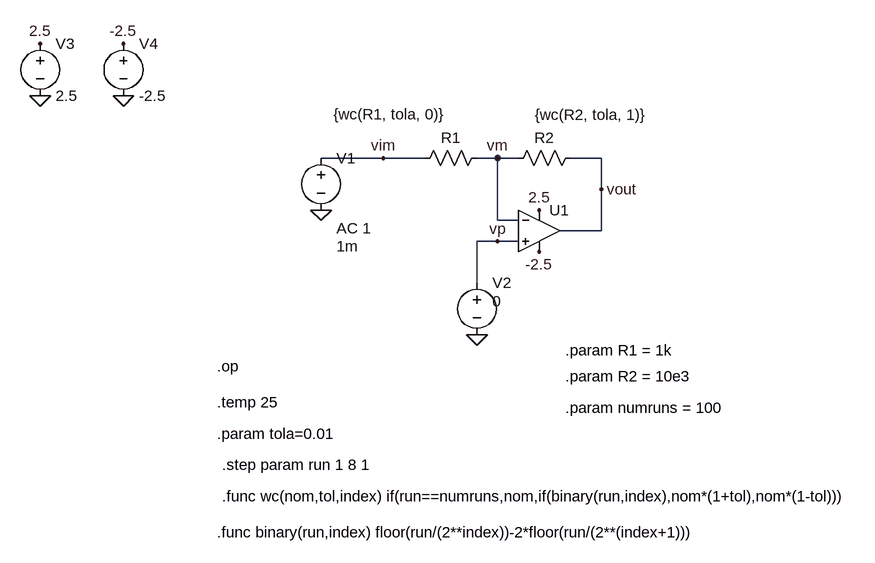
[diagram p0: schematic amplifier_wc.asc]
amplifier_wc.asc, the LTspice schematic file:
Version 4
SHEET 1 880 736
WIRE 16 48 -80 48
WIRE 80 48 16 48
WIRE 192 48 160 48
WIRE 224 48 192 48
WIRE 352 48 304 48
WIRE 352 96 352 48
WIRE 192 144 192 48
WIRE 224 144 192 144
WIRE 352 160 352 96
WIRE 352 160 288 160
WIRE 192 176 160 176
WIRE 224 176 192 176
WIRE 160 240 160 176
FLAG -80 128 0
FLAG -384 -48 0
FLAG -512 -48 0
FLAG -512 -128 2.5
FLAG -384 -128 -2.5
FLAG 256 128 2.5
FLAG 256 192 -2.5
FLAG 16 48 vim
FLAG 352 96 vout
FLAG 192 48 vm
FLAG 192 176 vp
FLAG 160 320 0
SYMBOL Opamps\\UniversalOpamp2 256 160 R0
SYMATTR InstName U1
SYMATTR SpiceModel level.1
SYMATTR Value2 Avol=10Meg GBW=1Meg Slew=10Meg
SYMBOL res 176 32 R90
WINDOW 0 0 56 VBottom 2
WINDOW 3 -67 150 VTop 2
SYMATTR InstName R1
SYMATTR Value {wc(R1, tola, 0)}
SYMBOL res 320 32 R90
WINDOW 0 0 56 VBottom 2
WINDOW 3 -66 -16 VTop 2
SYMATTR InstName R2
SYMATTR Value {wc(R2, tola, 1)}
SYMBOL voltage -80 32 R0
WINDOW 123 24 124 Left 2
WINDOW 39 0 0 Left 0
WINDOW 3 24 152 Left 2
SYMATTR Value2 AC 1
SYMATTR Value 1m
SYMATTR InstName V1
SYMBOL voltage -512 -144 R0
WINDOW 123 0 0 Left 0
WINDOW 39 0 0 Left 0
SYMATTR InstName V3
SYMATTR Value 2.5
SYMBOL voltage -384 -144 R0
WINDOW 123 0 0 Left 0
WINDOW 39 0 0 Left 0
SYMATTR InstName V4
SYMATTR Value -2.5
SYMBOL voltage 160 224 R0
WINDOW 3 24 44 Left 2
WINDOW 123 0 0 Left 0
WINDOW 39 0 0 Left 0
SYMATTR Value 0
SYMATTR InstName V2
TEXT -240 368 Left 2 !.op
TEXT -240 424 Left 2 !.temp 25
TEXT -240 472 Left 2 !.param tola=0.01
TEXT -232 520 Left 2 !.step param run 1 8 1
TEXT -232 568 Left 2 !.func wc(nom,tol,index) if(run==numruns,nom,if(binary(run,index),nom*(1+tol),nom*(1-tol)))
TEXT 296 344 Left 2 !.param R1 = 1k
TEXT 296 384 Left 2 !.param R2 = 10e3
TEXT 296 432 Left 2 !.param numruns = 100
TEXT -240 624 Left 2 !.func binary(run,index) floor(run/(2**index))-2*floor(run/(2**(index+1)))

The netlist it stands for:
* amplifier_wc.asc
XU1 vp vm 2.5 -2.5 vout level.1 Avol=10Meg GBW=1Meg Slew=10Meg ilimit=25m rail=0 Vos=0 phimargin=45 en=0 enk=0 in=0 ink=0 Rin=500Meg  ; pins IN+ IN- V+ V- OUT
R1 vm vim {wc(R1, tola, 0)}
R2 vout vm {wc(R2, tola, 1)}
V1 vim 0 1m AC 1
V3 2.5 0 2.5
V4 -2.5 0 -2.5
V2 vp 0 0
.op
.temp 25
.param tola=0.01
.step param run 1 8 1
.func wc(nom,tol,index) if(run==numruns,nom,if(binary(run,index),nom*(1+tol),nom*(1-tol)))
.param R1 = 1k
.param R2 = 10e3
.param numruns = 100
.func binary(run,index) floor(run/(2**index))-2*floor(run/(2**(index+1)))
.lib UniversalOpamps2.sub
.backanno
.end